# Altium schematic sheet USB.SchDoc: USB
size A4; DocumentNumber: MB1312; Revision: A-01; SheetNumber: 4; SheetTotal: 6; Project: NUCLEO-LXXXZX
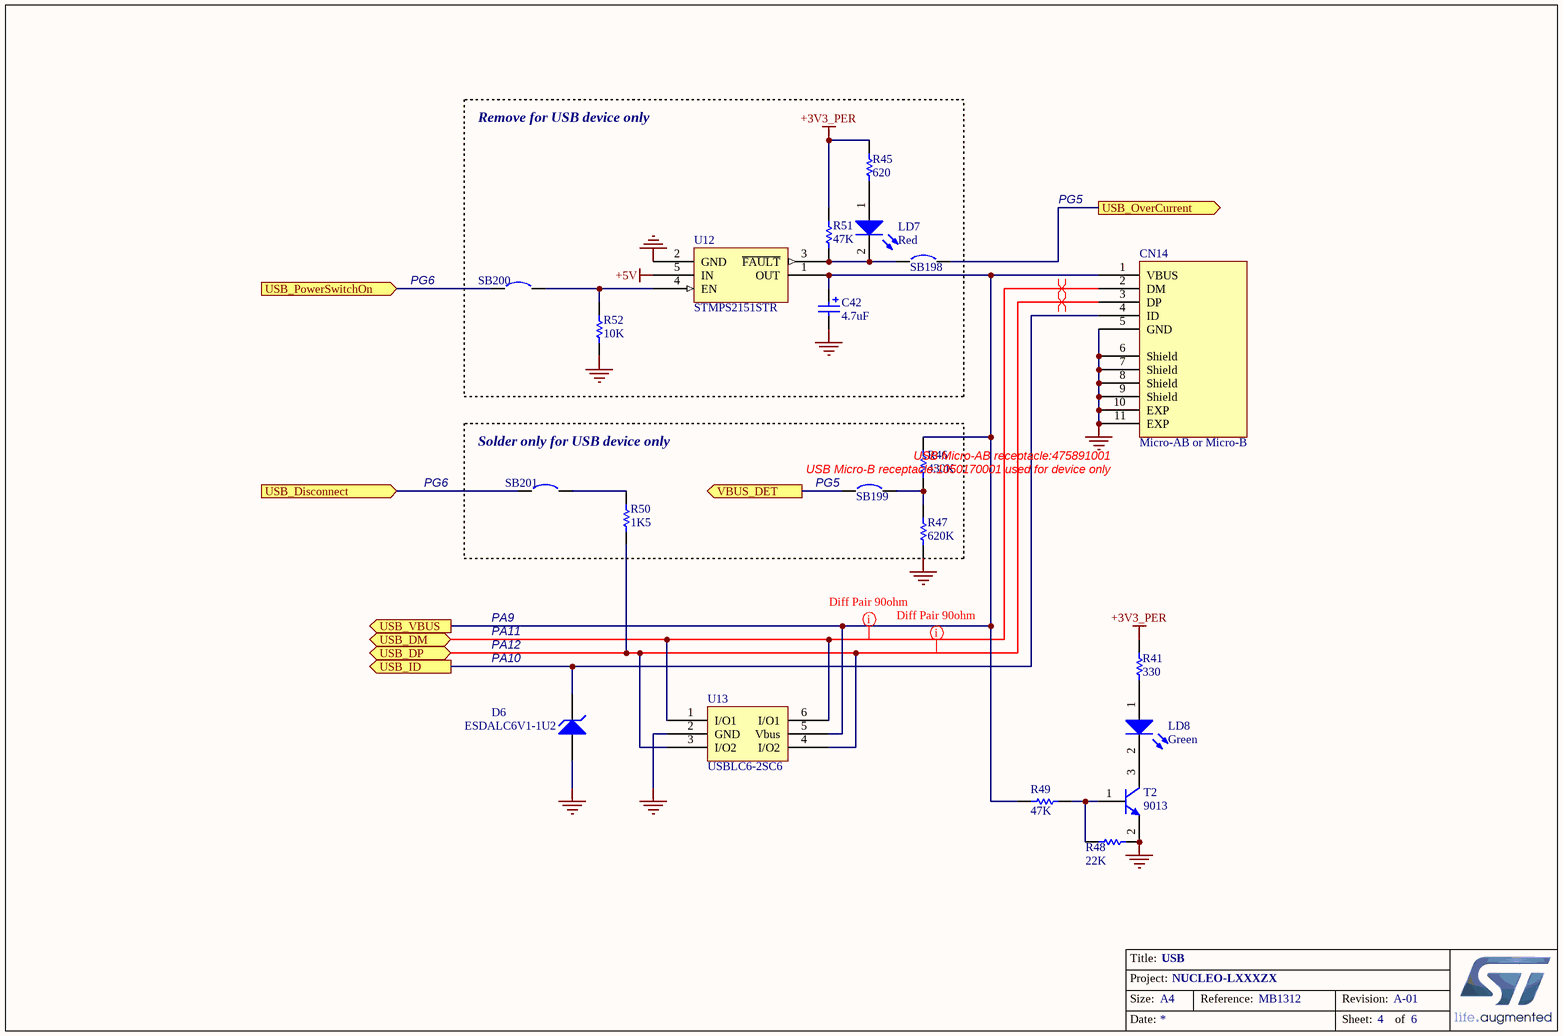
[diagram p0: USB.SchDoc]

## Parts
C42  4.7uF  [TAN-A]
CN14  Micro-AB or Micro-B  [Micro-AB or MicroB]
D6  ESDALC6V1-1U2  [ESDALC6V1-1U2]
LD7  Red  [0603D-R]
LD8  Green  [0603D-G]
R41  330  [0603R]
R45  620  [0603R]
R46  430K  [0603R]
R47  620K  [0603R]
R48  22K  [0603R]
R49  47K  [0603R]
R50  1K5  [0603R]
R51  47K  [0603R]
R52  10K  [0603R]
SB198  Circuit Breaker  [SB_0603]  (value not drawn)
SB199  Circuit Breaker  [SB_0603]  (value not drawn)
SB200  Circuit Breaker  [SB_0603]  (value not drawn)
SB201  Circuit Breaker  [SB_0603]  (value not drawn)
T2  9013  [SOT-23]
U12  STMPS2151STR  [SOT-23-5L]
U13  USBLC6-2SC6  [SOT23-6L]

## Blocks framed on the sheet
Remove for USB device only: C42 LD7 R45 R51 R52 SB198 SB200 U12
Solder only for USB device only: R46 R47 R50 SB199 SB201

## Ports
USB_Disconnect (in), USB_DM (bidir), USB_DP (bidir), USB_ID (out), USB_OverCurrent (out), USB_PowerSwitchOn (in), USB_VBUS (out), VBUS_DET (out)

## Nets
+3V3_PER: R41.2 R45.2 R51.1
+5V: U12.5(IN)
GND: C42.2 CN14.5(GND) CN14.6(Shield) CN14.7(Shield) CN14.8(Shield) CN14.9(Shield) CN14.10(EXP) CN14.11(EXP) D6.2(K) R47.2 R48.1 R52.1 T2.2(E) U12.2(GND) U13.2(GND)
USB_Disconnect: SB201.1 ; port USB_Disconnect
USB_DM: CN14.2(DM) U13.1(I/O1) U13.6(I/O1) ; port USB_DM
USB_DP: CN14.3(DP) R50.1 U13.3(I/O2) U13.4(I/O2) ; port USB_DP
USB_ID: CN14.4(ID) D6.1(A) ; port USB_ID
USB_OverCurrent: SB198.2 ; port USB_OverCurrent
USB_PowerSwitchOn: SB200.1 ; port USB_PowerSwitchOn
USB_VBUS: C42.1 CN14.1(VBUS) R46.1 R49.1 U12.1(OUT) U13.5(Vbus) ; port USB_VBUS
VBUS_DET: SB199.1 ; port VBUS_DET
NetLD7_1: LD7.1(A) R45.1
NetLD7_2: LD7.2(K) R51.2 SB198.1 U12.3(~{FAULT})
NetLD8_1: LD8.1(A) R41.1
NetLD8_2: LD8.2(K) T2.3(C)
NetR46_2: R46.2 R47.1 SB199.2
NetR48_2: R48.2 R49.2 T2.1(B)
NetR50_2: R50.2 SB201.2
NetR52_2: R52.2 SB200.2 U12.4(EN)

## Layout directives
mark named Diff Pair 90ohm: USB_DM, USB_DP
differential pair: USB_DM, USB_DP

## Notes on the sheet
- PG5
- PG6
- (near SB199) PG5
- (near CN14) USB Micro-AB receptacle:475891001
- (near CN14) USB Micro-B receptacle:1050170001 used for device only
- PA9
- PA12
- PA11
- PA10
- Title:
- Project:
- Size:
- Date:
- A4
- Reference:
- Sheet:
- Revision:
- of

## Library data of the parts
C42 = Cap Pol1: Polarized Capacitor (Radial); Value: 47uF; Published: 8-Jun-2000; Revision: July-2002: Re-released for DXP Platform.; Publisher: Altium Limited
CN14 = Micro-AB or Micro-B: Silkscreen: USB
D6 = ESDALC6V1-1U2: Zener Diode ESDALC6V1-1U2; Ordered by: STM; Published: 8-Jun-2000; LatestRevisionDate: 17-Jul-2002; LatestRevisionNote: Re-released for DXP Platform.; PackageReference: DIODE-0.7; Publisher: Altium Limited; PackageDescription: Diode, Thru-Hole; 2 Leads; 0.7 in Pin Spacing
LD7 LD8 = LED2: Typical RED, GREEN, YELLOW, AMBER GaAs LED; Published: 8-Jun-2000; Revision: July-2002: Re-released for DXP Platform.; Publisher: Altium Limited
R41 R46-R49 R51 = res1: Resistor; Value: 1K; Published: 8-Jun-2000; Revision: July-2002: Re-released for DXP Platform.; Publisher: Altium Limited
R45 R52 = Res1: Resistor; Value: 1K; Published: 8-Jun-2000; Revision: July-2002: Re-released for DXP Platform.; Publisher: Altium Limited
R50 = Resistor_ST: Resistor 0402 / 0603 / 0805; Description: Resistor 0402 or 0603 or 0805; Value: 10K
SB198-SB201 = Circuit Breaker: Solder: NO; Published: 24-Mar-1999; Revision: July-2002: Re-released for DXP Platform.; Publisher: Altium Limited
T2 = NPN: NPN Bipolar Transistor; Code - JEDEC: TO-226-AA; Published: 8-Jun-2000; Revision: July-2002: Re-released for DXP Platform.; Publisher: Altium Limited
U12 = STMPS2141STR